# EAGLE schematic parport (EAGLE 7.7.0)
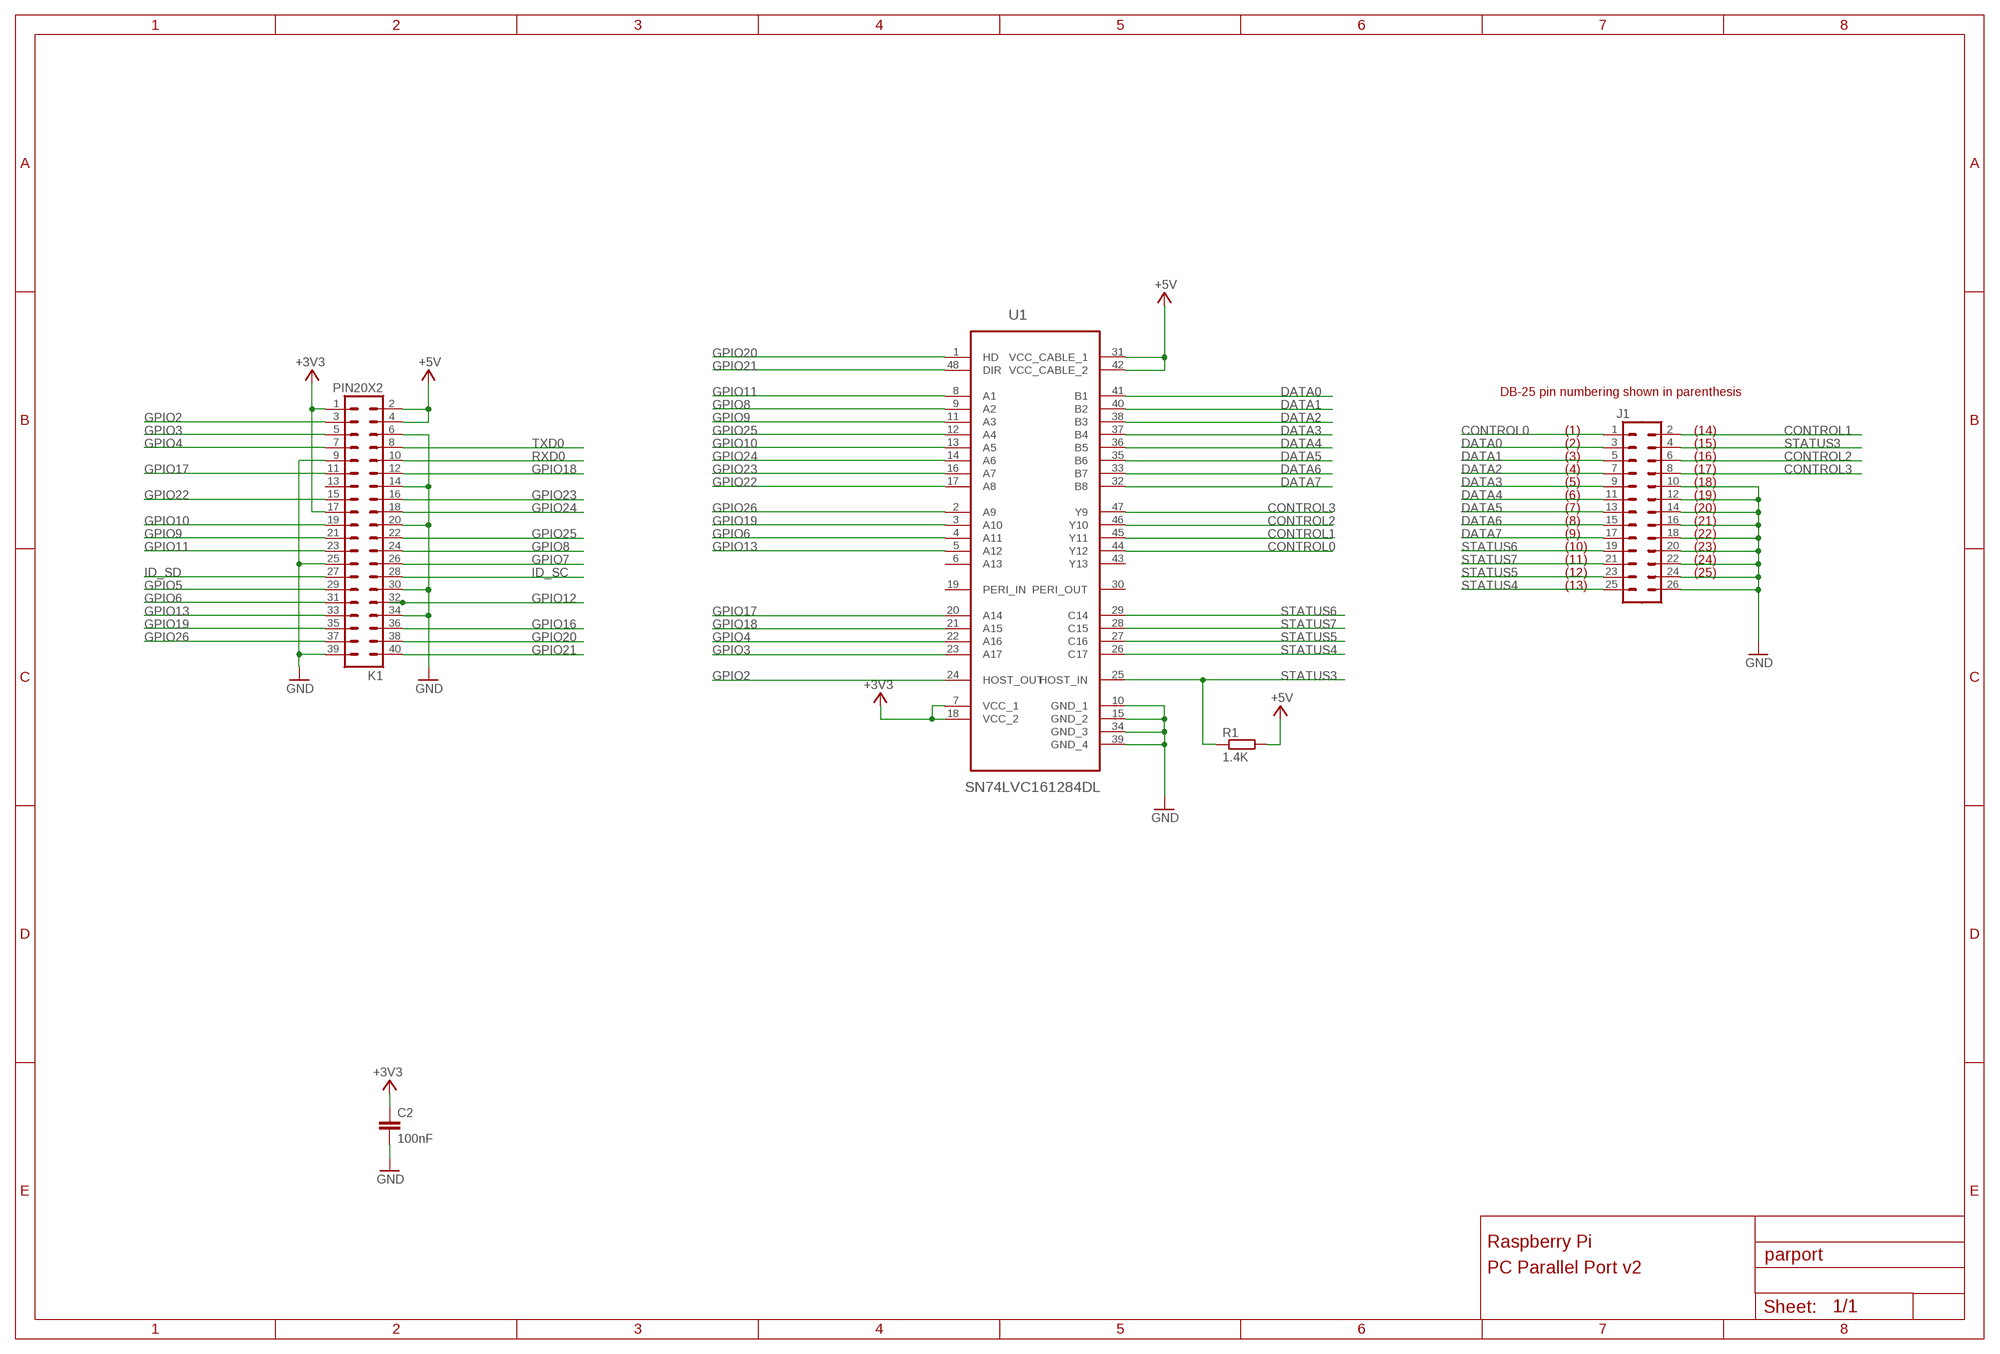
[diagram p0: schematic, sheet 1]

## Parts
C2  100nF  C-EUC0805  [C0805]
J1  M13X22X13  [2X13]
K1  PIN20X2  [PIN_20X2]
R1  1.4K  R-EU_R0805  [R0805]
U1  SN74LVC161284DL  [SOP63P1035X279-48N]

## Nets
+3V3: C2.1 K1.1 K1.17 U1.7(VCC_1) U1.18(VCC_2)
+5V: K1.2 K1.4 R1.2 U1.31(VCC_CABLE_1) U1.42(VCC_CABLE_2)
CONTROL0: J1.1 U1.44(Y12)
CONTROL1: J1.2 U1.45(Y11)
CONTROL2: J1.6 U1.46(Y10)
CONTROL3: J1.8 U1.47(Y9)
DATA0: J1.3 U1.41(B1)
DATA1: J1.5 U1.40(B2)
DATA2: J1.7 U1.38(B3)
DATA3: J1.9 U1.37(B4)
DATA4: J1.11 U1.36(B5)
DATA5: J1.13 U1.35(B6)
DATA6: J1.15 U1.33(B7)
DATA7: J1.17 U1.32(B8)
GND: C2.2 J1.10 J1.12 J1.14 J1.16 J1.18 J1.20 J1.22 J1.24 J1.26 K1.6 K1.9 K1.14 K1.20 K1.25 K1.30 K1.34 K1.39 U1.10(GND_1) U1.15(GND_2) U1.34(GND_3) U1.39(GND_4)
GPIO2: K1.3 U1.24(HOST_OUT)
GPIO3: K1.5 U1.23(A17)
GPIO4: K1.7 U1.22(A16)
GPIO5: K1.29
GPIO6: K1.31 U1.4(A11)
GPIO7: K1.26
GPIO8: K1.24 U1.9(A2)
GPIO9: K1.21 U1.11(A3)
GPIO10: K1.19 U1.13(A5)
GPIO11: K1.23 U1.8(A1)
GPIO12: K1.32
GPIO13: K1.33 U1.5(A12)
GPIO16: K1.36
GPIO17: K1.11 U1.20(A14)
GPIO18: K1.12 U1.21(A15)
GPIO19: K1.35 U1.3(A10)
GPIO20: K1.38 U1.1(HD)
GPIO21: K1.40 U1.48(DIR)
GPIO22: K1.15 U1.17(A8)
GPIO23: K1.16 U1.16(A7)
GPIO24: K1.18 U1.14(A6)
GPIO25: K1.22 U1.12(A4)
GPIO26: K1.37 U1.2(A9)
ID_SC: K1.28
ID_SD: K1.27
RXD0: K1.10
STATUS3: J1.4 R1.1 U1.25(HOST_IN)
STATUS4: J1.25 U1.26(C17)
STATUS5: J1.23 U1.27(C16)
STATUS6: J1.19 U1.29(C14)
STATUS7: J1.21 U1.28(C15)
TXD0: K1.8
Unconnected: K1.13 U1.6(A13) U1.19(PERI_IN) U1.30(PERI_OUT) U1.43(Y13)

## Notes on the sheet
- DB-25 pin numbering shown in parenthesis
- (1) | (14)
- (2) | (15)
- (3) | (16)
- (4) | (17)
- (5) | (18)
- (6) | (19)
- (7) | (20)
- (8) | (21)
- (9) | (22)
- (10) | (23)
- (11) | (24)
- (12) | (25)
- (13)
- Raspberry Pi
- PC Parallel Port v2

## Library data of the parts
C2 = resistor:C-EU: CAPACITOR, European symbol
J1 = SparkFun-Connectors:M13X2: 0.1" spaced headers
K1 = FLYFISH:PIN20X2
R1 = resistor:R-EU_: RESISTOR, European symbol
U1 = worlickwerx:SN74LVC161284DL: 19-Bit Bus Interface With 3-State Outputs; MPN: SN74LVC161284DL; PACKAGE: 48-SSOP; SUPPLIER: Texas Instruments